# Altium schematic sheet 原理图_模电_2025-09-03.schdoc
size 292 x 187 mm
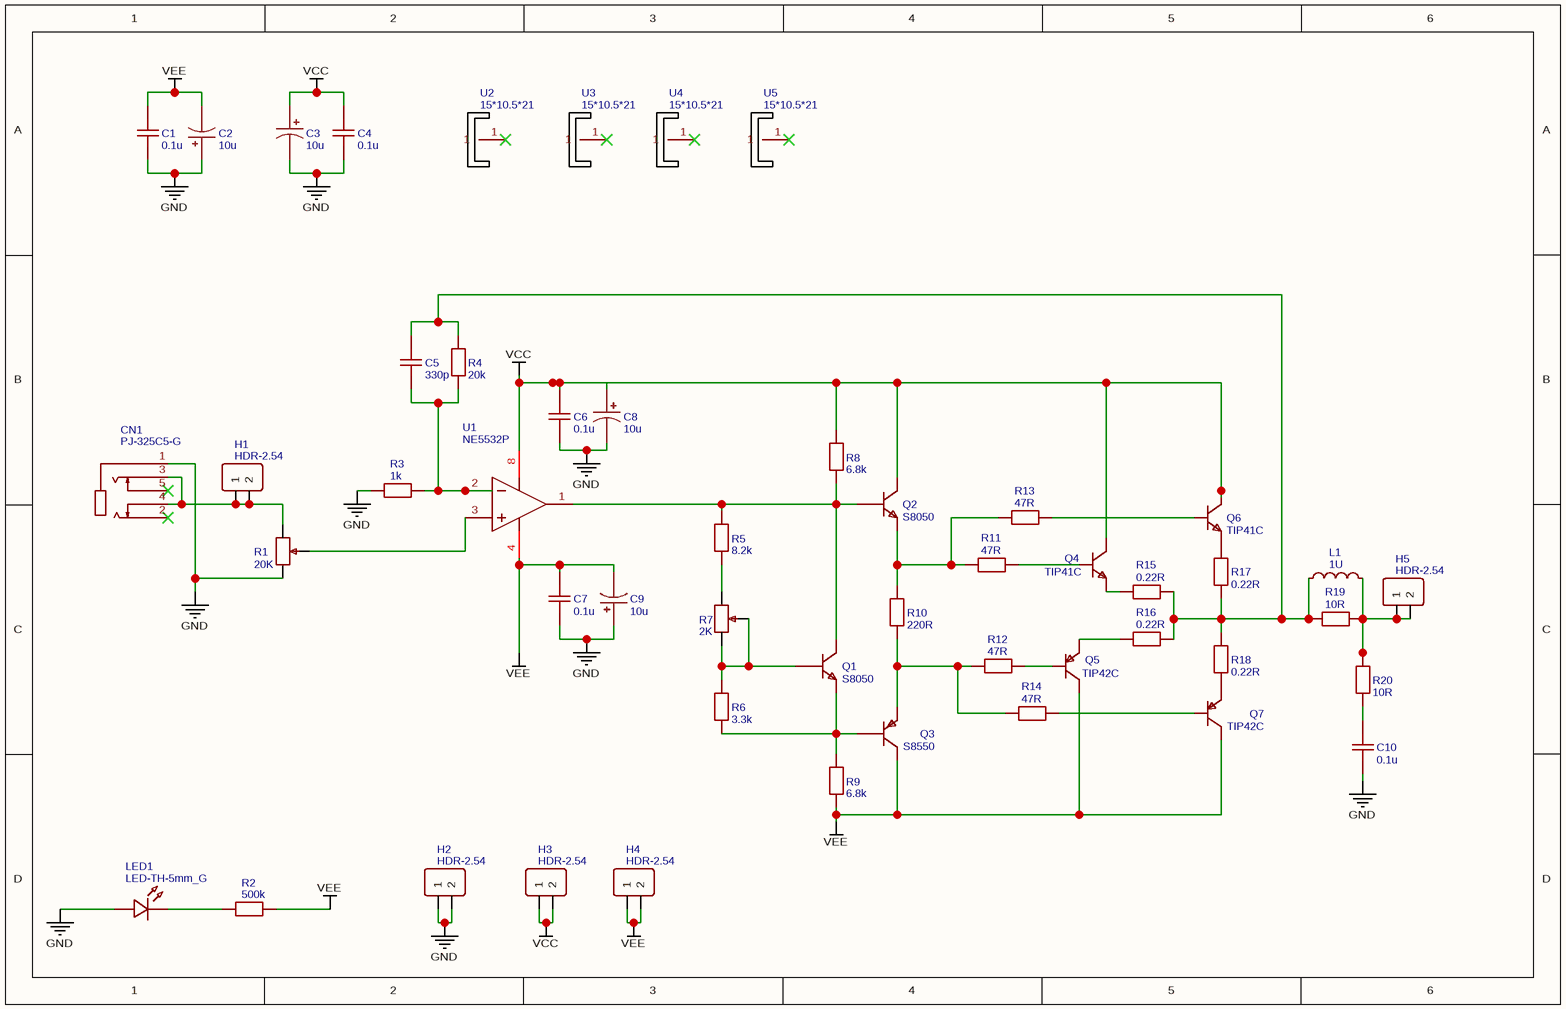
[diagram p0: 原理图_模电_2025-09-03.schdoc]

## Parts
C1  0.1u  [RAD-0.1]
C2  10u  [CAP-D6.3×F2.5]
C3  10u  [CAP-D6.3×F2.5]
C4  0.1u  [RAD-0.1]
C5  330p  [RAD-0.1]
C6  0.1u  [RAD-0.1]
C7  0.1u  [RAD-0.1]
C8  10u  [CAP-D6.3×F2.5]
C9  10u  [CAP-D6.3×F2.5]
C10  0.1u  [RAD-0.1]
CN1  PJ-325C5-G  [AUDIO-TH_PJ-325C5-G]
H1  HDR-2.54  [HDR-F-2.54_1X2]
H2  HDR-2.54  [HDR-F-2.54_1X2]
H3  HDR-2.54  [HDR-F-2.54_1X2]
H4  HDR-2.54  [HDR-F-2.54_1X2]
H5  HDR-2.54  [HDR-F-2.54_1X2]
L1  1U  [L_AXIAL-0.6]
LED1  LED-TH-5mm_G  [LED-TH_BD5.0_GREEN]
Q1  S8050  [TO-92-3_L4.9-W3.7-P1.27-L]
Q2  S8050  [TO-92-3_L4.9-W3.7-P1.27-L]
Q3  S8550  [TO-92-3_L4.9-W3.7-P1.27-L]
Q4  TIP41C  [TO-220-3_L10.0-W4.5-P2.54-T]
Q5  TIP42C  [TO-220-3_L10.0-W4.5-P2.54-T]
Q6  TIP41C  [TO-220-3_L10.0-W4.5-P2.54-T]
Q7  TIP42C  [TO-220-3_L10.0-W4.5-P2.54-T]
R1  20K  [RES-ADJ-TH_EVND8AA]
R2  500k  [R_AXIAL-0.5]
R3  1k  [R_AXIAL-0.5]
R4  20k  [R_AXIAL-0.5]
R5  8.2k  [R_AXIAL-0.5]
R6  3.3k  [R_AXIAL-0.5]
R7  2K  [RES-ADJ-TH_VZ067TL1B202]
R8  6.8k  [R_AXIAL-0.5]
R9  6.8k  [R_AXIAL-0.5]
R10  220R  [R_AXIAL-0.5]
R11  47R  [R_AXIAL-0.5]
R12  47R  [R_AXIAL-0.5]
R13  47R  [R_AXIAL-0.5]
R14  47R  [R_AXIAL-0.5]
R15  0.22R  [R_AXIAL-0.5]
R16  0.22R  [R_AXIAL-0.5]
R17  0.22R  [R_AXIAL-0.5]
R18  0.22R  [R_AXIAL-0.5]
R19  10R  [R_AXIAL-0.5]
R20  10R  [R_AXIAL-0.5]
U1  NE5532P  [DIP-8_L9.4-W6.4-P2.54-LS9.1-BL]
U2  15*10.5*21  [SINK-TH_L15.0-W10.5-H21.0]
U3  15*10.5*21  [SINK-TH_L15.0-W10.5-H21.0]
U4  15*10.5*21  [SINK-TH_L15.0-W10.5-H21.0]
U5  15*10.5*21  [SINK-TH_L15.0-W10.5-H21.0]

## Nets
GND: C1.1 C2.1 C3.2 C4.2 C6.1 C7.1 C8.2 C9.1 C10.1 CN1.1 H2.1 H2.2 LED1.1 R1.1 R3.1
VCC: C3.1 C4.1 C6.2 C8.1 H3.1 H3.2 Q2.3(C) Q4.2(C) Q6.2(C) R8.2 U1.8(VCC+)
VEE: C1.2 C2.2 C7.2 C9.2 H4.1 H4.2 Q3.3(C) Q5.2(C) Q7.2(C) R2.2 R9.1 U1.4(VCC-)
NetC5_1: C5.1 R3.2 R4.1 U1.2(IN1-)
NetC5_2: C5.2 L1.1 R4.2 R15.1 R16.1 R17.2 R18.1 R19.2
NetC10_2: C10.2 R20.2
NetCN1_3: CN1.3 CN1.4 H1.1 H1.2 R1.3
NetH5_1: H5.1 H5.2 L1.2 R19.1 R20.1
NetLED1_2: LED1.2 R2.1
NetQ1_1: Q1.1(E) Q3.2(B) R6.1 R9.2
NetQ1_2: Q1.2(B) R6.2 R7.2 R7.3
NetQ1_3: Q1.3(C) Q2.2(B) R5.2 R8.1 U1.1(OUT1)
NetQ2_1: Q2.1(E) R10.2 R11.2 R13.2
NetQ3_1: Q3.1(E) R10.1 R12.2 R14.2
NetQ4_1: Q4.1(B) R11.1
NetQ4_3: Q4.3(E) R15.2
NetQ5_1: Q5.1(B) R12.1
NetQ5_3: Q5.3(E) R16.2
NetQ6_1: Q6.1(B) R13.1
NetQ6_3: Q6.3(E) R17.1
NetQ7_1: Q7.1(B) R14.1
NetQ7_3: Q7.3(E) R18.2
NetR1_2: R1.2 U1.3(IN1+)
NetR5_1: R5.1 R7.1

Not connected (* = marked no-connect by the designer): CN1 2* 5*; U2 1*; U3 1*; U4 1*; U5 1*

## Library data of the parts
C1 C4 C6 C7 C10 = 0.1u: nameAlias: Value(F); Contributor: LCEDA_Lib; spicePre: C; spiceSymbolName: C_RAD-0.3_US
C2 C3 C8 C9 = 10u: nameAlias: Value(F); Contributor: LCEDA_Lib; spicePre: C; spiceSymbolName: CE_TH_D6.3×F2.5_US
C5 = 330p: nameAlias: Value(F); Contributor: LCEDA_Lib; spicePre: C; spiceSymbolName: C_RAD-0.3_US
CN1 = PJ-325C5-G: Manufacturer: XKB Connectivity; Contributor: LCSC; Supplier: LCSC; Supplier Part: C692438; Manufacturer Part: PJ-325C5-G; spicePre: C; spiceSymbolName: PJ-325C5-G
H1-H5 = HDR-2.54: Contributor: LCEDA_Lib; Supplier Part: C49661; Supplier: LCSC; spicePre: H; spiceSymbolName: HDR-F-2.54_1x2
L1 = 1U: nameAlias: Value(H); Contributor: LCEDA_Lib; spicePre: L; spiceSymbolName: L_AXIAL-0.6_US
LED1 = LED-TH-5mm_G: Manufacturer: EVERLIGHT(台湾亿光); Manufacturer Part: 333-2SYGD/S530-E2; Contributor: LCEDA_Lib; Supplier Part: C88163; Supplier: LCSC; spicePre: L; spiceSymbolName: LED-TH-5mm_G
Q1 Q2 = S8050: Manufacturer: CJ; Contributor: 立创EDA官方封装库; Supplier: LCSC; Manufacturer Part: S8050; Supplier Part: C141642; spicePre: Q; spiceSymbolName: S8050_C141642
Q3 = S8550: Manufacturer: CJ; Contributor: LCSC; Supplier: LCSC; Manufacturer Part: S8550; Supplier Part: C141645; spicePre: Q; spiceSymbolName: S8550
Q4 Q6 = TIP41C: Manufacturer: CJ; Supplier: LCSC; Manufacturer Part: TIP41C; Supplier Part: C92310; spicePre: Q; spiceSymbolName: TIP41C
Q5 Q7 = TIP42C: Manufacturer: CJ; Supplier: LCSC; Manufacturer Part: TIP42C; Supplier Part: C92311; spicePre: Q; spiceSymbolName: TIP42C
R1 = 20K: Manufacturer: PANASONIC; Manufacturer Part: EVND8AA03B24; nameAlias: Resistance (Ohms); Contributor: LCSC; Supplier: LCSC; Resistance(Ohms): 20K; Supplier Part: C5017; spicePre: R; spiceSymbolName: EVND8AA03B24
R2 = 500k: nameAlias: Value(Ω); Contributor: LCEDA_Lib; spicePre: R; spiceSymbolName: R_AXIAL-1.0_EU
R3 = 1k: nameAlias: Value(Ω); Contributor: LCEDA_Lib; spicePre: R; spiceSymbolName: R_AXIAL-1.0_EU
R4 = 20k: nameAlias: Value(Ω); Contributor: LCEDA_Lib; spicePre: R; spiceSymbolName: R_AXIAL-1.0_EU
R5 = 8.2k: nameAlias: Value(Ω); Contributor: LCEDA_Lib; spicePre: R; spiceSymbolName: R_AXIAL-1.0_EU
R6 = 3.3k: nameAlias: Value(Ω); Contributor: LCEDA_Lib; spicePre: R; spiceSymbolName: R_AXIAL-1.0_EU
R7 = 2K: Manufacturer: HDK; Manufacturer Part: VZ067TL1B202; nameAlias: Resistance (Ohms); Contributor: LCSC; Supplier: LCSC; Resistance(Ohms): 2K; Supplier Part: C128567; spicePre: R; spiceSymbolName: VZ067TL1B202
R8 R9 = 6.8k: nameAlias: Value(Ω); Contributor: LCEDA_Lib; spicePre: R; spiceSymbolName: R_AXIAL-1.0_EU
R10 = 220R: nameAlias: Value(Ω); Contributor: LCEDA_Lib; spicePre: R; spiceSymbolName: R_AXIAL-1.0_EU
R11-R14 = 47R: nameAlias: Value(Ω); Contributor: LCEDA_Lib; spicePre: R; spiceSymbolName: R_AXIAL-1.0_EU
R15-R18 = 0.22R: nameAlias: Value(Ω); Contributor: LCEDA_Lib; spicePre: R; spiceSymbolName: R_AXIAL-1.0_EU
R19 R20 = 10R: nameAlias: Value(Ω); Contributor: LCEDA_Lib; spicePre: R; spiceSymbolName: R_AXIAL-1.0_EU
U1 = NE5532P: Manufacturer: TI; subpart_no: 1; tags: Audio Operational Amplifier; timeStamp: 1460221582; Supplier Part: C5326; Supplier: LCSC; Manufacturer Part: NE5532P; image: http://image.lceda.cn/szlcsc/C5326.jpg; spicePre: U; spiceSymbolName: NE5532P
U2-U5 = 15*10.5*21: Manufacturer: Made in China; Contributor: LCSC; Supplier: LCSC; Supplier Part: C4649; Manufacturer Part: -; spicePre: U; spiceSymbolName: 15*10.5*21